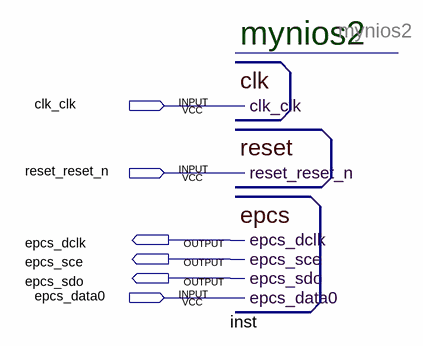
[diagram p0: schematic sheet]
// Quartus schematic base_system_qsys.bdf as structural Verilog: 1 symbols, 6 pins
module base_system_qsys (
  input  clk_clk,
  input  reset_reset_n,
  input  epcs_data0,
  output epcs_dclk,
  output epcs_sce,
  output epcs_sdo
);

  mynios2 inst (
    .clk_clk(clk_clk), .reset_reset_n(reset_reset_n), .epcs_data0(epcs_data0), .epcs_dclk(epcs_dclk),
    .epcs_sce(epcs_sce), .epcs_sdo(epcs_sdo));
endmodule
